# Altium schematic sheet Shift register.SchDoc
size 297 x 209 mm
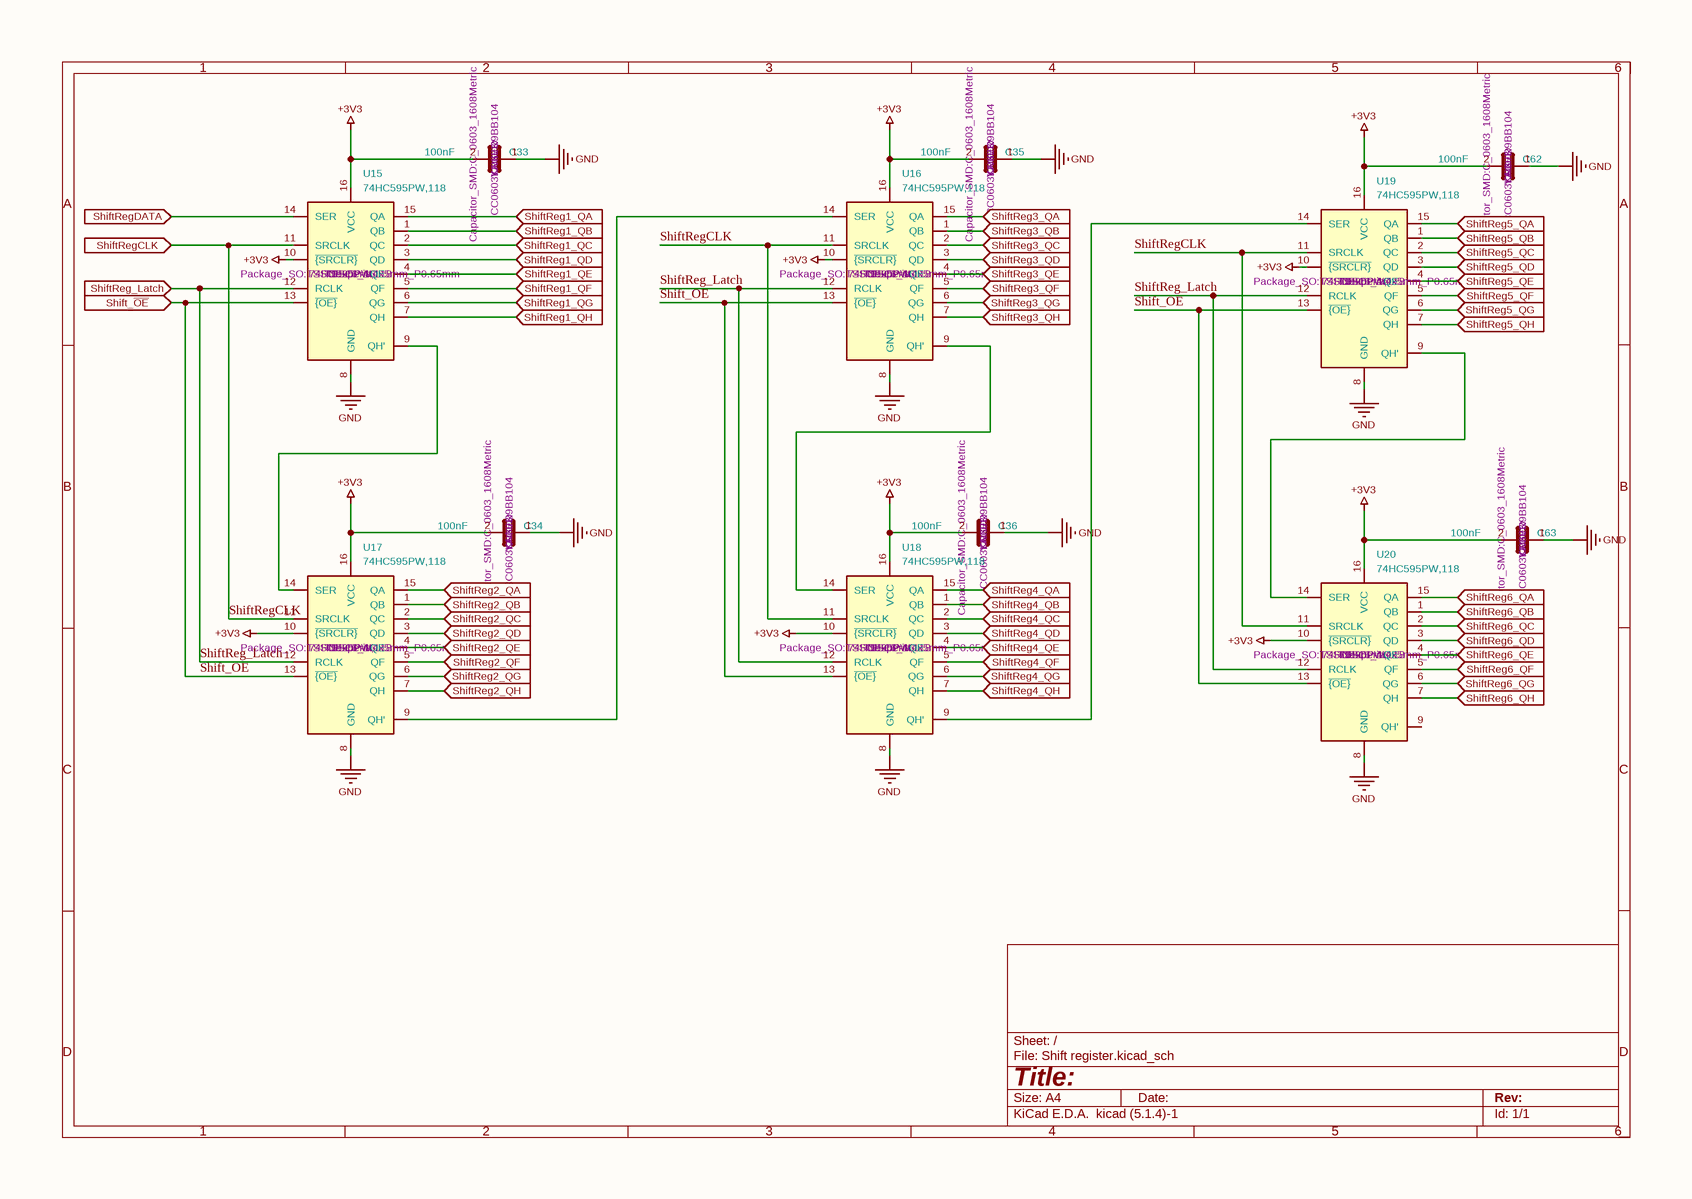
[diagram p0: Shift register.SchDoc]

## Parts
C33  Manufacturer Part Number: CC0603KRX7R9BB104  Manufacturer: YAGEO  Package: C0603  Footprint: Capacitor_SMD:C_0603_1608Metric  [C_0603_1608Metric]  (hidden comment: 100nF)
C34  Manufacturer Part Number: CC0603KRX7R9BB104  Manufacturer: YAGEO  Package: C0603  Footprint: Capacitor_SMD:C_0603_1608Metric  [C_0603_1608Metric]  (hidden comment: 100nF)
C35  Manufacturer Part Number: CC0603KRX7R9BB104  Manufacturer: YAGEO  Package: C0603  Footprint: Capacitor_SMD:C_0603_1608Metric  [C_0603_1608Metric]  (hidden comment: 100nF)
C36  Manufacturer Part Number: CC0603KRX7R9BB104  Manufacturer: YAGEO  Package: C0603  Footprint: Capacitor_SMD:C_0603_1608Metric  [C_0603_1608Metric]  (hidden comment: 100nF)
C62  Manufacturer Part Number: CC0603KRX7R9BB104  Manufacturer: YAGEO  Package: C0603  Footprint: Capacitor_SMD:C_0603_1608Metric  [C_0603_1608Metric]  (hidden comment: 100nF)
C63  Manufacturer Part Number: CC0603KRX7R9BB104  Manufacturer: YAGEO  Package: C0603  Footprint: Capacitor_SMD:C_0603_1608Metric  [C_0603_1608Metric]  (hidden comment: 100nF)
U15  Manufacturer: Nexperia  Package: TSSOP-16  Footprint: Package_SO:TSSOP-16_4.4x5mm_P0.65mm  [TSSOP-16_4.4x5mm_P0.65mm]  (hidden comment: 74HC595PW,118)
U16  Manufacturer: Nexperia  Package: TSSOP-16  Footprint: Package_SO:TSSOP-16_4.4x5mm_P0.65mm  [TSSOP-16_4.4x5mm_P0.65mm]  (hidden comment: 74HC595PW,118)
U17  Manufacturer: Nexperia  Package: TSSOP-16  Footprint: Package_SO:TSSOP-16_4.4x5mm_P0.65mm  [TSSOP-16_4.4x5mm_P0.65mm]  (hidden comment: 74HC595PW,118)
U18  Manufacturer: Nexperia  Package: TSSOP-16  Footprint: Package_SO:TSSOP-16_4.4x5mm_P0.65mm  [TSSOP-16_4.4x5mm_P0.65mm]  (hidden comment: 74HC595PW,118)
U19  Manufacturer: Nexperia  Package: TSSOP-16  Footprint: Package_SO:TSSOP-16_4.4x5mm_P0.65mm  [TSSOP-16_4.4x5mm_P0.65mm]  (hidden comment: 74HC595PW,118)
U20  Manufacturer: Nexperia  Package: TSSOP-16  Footprint: Package_SO:TSSOP-16_4.4x5mm_P0.65mm  [TSSOP-16_4.4x5mm_P0.65mm]  (hidden comment: 74HC595PW,118)

## Ports
Shift_~{OE} (in, see KNX-RELAY-24CH_V0.2[4A]), ShiftReg1_QA (in, see KNX-RELAY-24CH_V0.2[3C]), ShiftReg1_QB (in, see KNX-RELAY-24CH_V0.2[3C]), ShiftReg1_QC (in, see KNX-RELAY-24CH_V0.2[3C]), ShiftReg1_QD (in, see KNX-RELAY-24CH_V0.2[3C]), ShiftReg1_QE (in, see KNX-RELAY-24CH_V0.2[3C]), ShiftReg1_QF (in, see KNX-RELAY-24CH_V0.2[3A]), ShiftReg1_QG (in, see KNX-RELAY-24CH_V0.2[3B]), ShiftReg1_QH (in, see KNX-RELAY-24CH_V0.2[3A]), ShiftReg2_QA (in, see KNX-RELAY-24CH_V0.2[3B]), ShiftReg2_QB (in, see KNX-RELAY-24CH_V0.2[3A]), ShiftReg2_QC (in, see KNX-RELAY-24CH_V0.2[3B]), ShiftReg2_QD (in, see KNX-RELAY-24CH_V0.2[3A]), ShiftReg2_QE (in, see KNX-RELAY-24CH_V0.2[3B]), ShiftReg2_QF (in, see KNX-RELAY-24CH_V0.2[3A]), ShiftReg2_QG (in, see KNX-RELAY-24CH_V0.2[3B]), ShiftReg2_QH (in, see KNX-RELAY-24CH_V0.2[3A]), ShiftReg3_QA (in, see KNX-RELAY-24CH_V0.2[3B]), ShiftReg3_QB (in, see KNX-RELAY-24CH_V0.2[3A]), ShiftReg3_QC (in, see KNX-RELAY-24CH_V0.2[3B]), ShiftReg3_QD (in, see KNX-RELAY-24CH_V0.2[3C]), ShiftReg3_QE (in, see KNX-RELAY-24CH_V0.2[3C]), ShiftReg3_QF (in, see KNX-RELAY-24CH_V0.2[3C]), ShiftReg3_QG (in, see KNX-RELAY-24CH_V0.2[3C]), ShiftReg3_QH (in, see KNX-RELAY-24CH_V0.2[3B]), ShiftReg4_QA (in, see KNX-RELAY-24CH_V0.2[3B]), ShiftReg4_QB (in, see KNX-RELAY-24CH_V0.2[3B]), ShiftReg4_QC (in, see KNX-RELAY-24CH_V0.2[3B]), ShiftReg4_QD (in, see KNX-RELAY-24CH_V0.2[3B]), ShiftReg4_QE (in, see KNX-RELAY-24CH_V0.2[3C]), ShiftReg4_QF (in, see KNX-RELAY-24CH_V0.2[3C]), ShiftReg4_QG (in, see KNX-RELAY-24CH_V0.2[3C]), ShiftReg4_QH (in, see KNX-RELAY-24CH_V0.2[3C]), ShiftReg5_QA (in, see KNX-RELAY-24CH_V0.2[3A]), ShiftReg5_QB (in, see KNX-RELAY-24CH_V0.2[3B]), ShiftReg5_QC (in, see KNX-RELAY-24CH_V0.2[3A]), ShiftReg5_QD (in, see KNX-RELAY-24CH_V0.2[3B]), ShiftReg5_QE (in, see KNX-RELAY-24CH_V0.2[3A]), ShiftReg5_QF (in, see KNX-RELAY-24CH_V0.2[3B]), ShiftReg5_QG (in, see KNX-RELAY-24CH_V0.2[3A]), ShiftReg5_QH (in, see KNX-RELAY-24CH_V0.2[3B]), ShiftReg6_QA (in, see KNX-RELAY-24CH_V0.2[3A]), ShiftReg6_QB (in, see KNX-RELAY-24CH_V0.2[3B]), ShiftReg6_QC (in, see KNX-RELAY-24CH_V0.2[3A]), ShiftReg6_QD (in, see KNX-RELAY-24CH_V0.2[3C]), ShiftReg6_QE (in, see KNX-RELAY-24CH_V0.2[3C]), ShiftReg6_QF (in, see KNX-RELAY-24CH_V0.2[3C]), ShiftReg6_QG (in, see KNX-RELAY-24CH_V0.2[3C]), ShiftReg6_QH (in, see KNX-RELAY-24CH_V0.2[3C]), ShiftReg_Latch (in, see KNX-RELAY-24CH_V0.2[4A]), ShiftRegCLK (in, see KNX-RELAY-24CH_V0.2[4A]), ShiftRegDATA (in, see KNX-RELAY-24CH_V0.2[4A])

## Nets
+3V3: C33.2 C34.2 C35.2 C36.2 C62.2 C63.2 U15.10(~{{SRCLR}}) U15.16(VCC) U16.10(~{{SRCLR}}) U16.16(VCC) U17.10(~{{SRCLR}}) U17.16(VCC) U18.10(~{{SRCLR}}) U18.16(VCC) U19.10(~{{SRCLR}}) U19.16(VCC) U20.10(~{{SRCLR}}) U20.16(VCC)
GND: C33.1 C34.1 C35.1 C36.1 C62.1 C63.1 U15.8(GND) U16.8(GND) U17.8(GND) U18.8(GND) U19.8(GND) U20.8(GND)
Shift_~{OE}: U15.13(~{{OE}}) U16.13(~{{OE}}) U17.13(~{{OE}}) U18.13(~{{OE}}) U19.13(~{{OE}}) U20.13(~{{OE}}) ; port Shift_~{OE}
ShiftReg1_QA: U15.15(QA) ; port ShiftReg1_QA
ShiftReg1_QB: U15.1(QB) ; port ShiftReg1_QB
ShiftReg1_QC: U15.2(QC) ; port ShiftReg1_QC
ShiftReg1_QD: U15.3(QD) ; port ShiftReg1_QD
ShiftReg1_QE: U15.4(QE) ; port ShiftReg1_QE
ShiftReg1_QF: U15.5(QF) ; port ShiftReg1_QF
ShiftReg1_QG: U15.6(QG) ; port ShiftReg1_QG
ShiftReg1_QH: U15.7(QH) ; port ShiftReg1_QH
ShiftReg2_QA: U17.15(QA) ; port ShiftReg2_QA
ShiftReg2_QB: U17.1(QB) ; port ShiftReg2_QB
ShiftReg2_QC: U17.2(QC) ; port ShiftReg2_QC
ShiftReg2_QD: U17.3(QD) ; port ShiftReg2_QD
ShiftReg2_QE: U17.4(QE) ; port ShiftReg2_QE
ShiftReg2_QF: U17.5(QF) ; port ShiftReg2_QF
ShiftReg2_QG: U17.6(QG) ; port ShiftReg2_QG
ShiftReg2_QH: U17.7(QH) ; port ShiftReg2_QH
ShiftReg3_QA: U16.15(QA) ; port ShiftReg3_QA
ShiftReg3_QB: U16.1(QB) ; port ShiftReg3_QB
ShiftReg3_QC: U16.2(QC) ; port ShiftReg3_QC
ShiftReg3_QD: U16.3(QD) ; port ShiftReg3_QD
ShiftReg3_QE: U16.4(QE) ; port ShiftReg3_QE
ShiftReg3_QF: U16.5(QF) ; port ShiftReg3_QF
ShiftReg3_QG: U16.6(QG) ; port ShiftReg3_QG
ShiftReg3_QH: U16.7(QH) ; port ShiftReg3_QH
ShiftReg4_QA: U18.15(QA) ; port ShiftReg4_QA
ShiftReg4_QB: U18.1(QB) ; port ShiftReg4_QB
ShiftReg4_QC: U18.2(QC) ; port ShiftReg4_QC
ShiftReg4_QD: U18.3(QD) ; port ShiftReg4_QD
ShiftReg4_QE: U18.4(QE) ; port ShiftReg4_QE
ShiftReg4_QF: U18.5(QF) ; port ShiftReg4_QF
ShiftReg4_QG: U18.6(QG) ; port ShiftReg4_QG
ShiftReg4_QH: U18.7(QH) ; port ShiftReg4_QH
ShiftReg5_QA: U19.15(QA) ; port ShiftReg5_QA
ShiftReg5_QB: U19.1(QB) ; port ShiftReg5_QB
ShiftReg5_QC: U19.2(QC) ; port ShiftReg5_QC
ShiftReg5_QD: U19.3(QD) ; port ShiftReg5_QD
ShiftReg5_QE: U19.4(QE) ; port ShiftReg5_QE
ShiftReg5_QF: U19.5(QF) ; port ShiftReg5_QF
ShiftReg5_QG: U19.6(QG) ; port ShiftReg5_QG
ShiftReg5_QH: U19.7(QH) ; port ShiftReg5_QH
ShiftReg6_QA: U20.15(QA) ; port ShiftReg6_QA
ShiftReg6_QB: U20.1(QB) ; port ShiftReg6_QB
ShiftReg6_QC: U20.2(QC) ; port ShiftReg6_QC
ShiftReg6_QD: U20.3(QD) ; port ShiftReg6_QD
ShiftReg6_QE: U20.4(QE) ; port ShiftReg6_QE
ShiftReg6_QF: U20.5(QF) ; port ShiftReg6_QF
ShiftReg6_QG: U20.6(QG) ; port ShiftReg6_QG
ShiftReg6_QH: U20.7(QH) ; port ShiftReg6_QH
ShiftReg_Latch: U15.12(RCLK) U16.12(RCLK) U17.12(RCLK) U18.12(RCLK) U19.12(RCLK) U20.12(RCLK) ; port ShiftReg_Latch
ShiftRegCLK: U15.11(SRCLK) U16.11(SRCLK) U17.11(SRCLK) U18.11(SRCLK) U19.11(SRCLK) U20.11(SRCLK) ; port ShiftRegCLK
ShiftRegDATA: U15.14(SER) ; port ShiftRegDATA
NetU15_9: U15.9(QH') U17.14(SER)
NetU16_9: U16.9(QH') U18.14(SER)
NetU16_14: U16.14(SER) U17.9(QH')
NetU18_9: U18.9(QH') U19.14(SER)
NetU19_9: U19.9(QH') U20.14(SER)

Not connected (* = marked no-connect by the designer): U20 9(QH')

## Notes on the sheet
- 1
- 2
- 3
- 4
- 5
- 6
- A
- B
- C
- D
- Title:
- File: Shift register.kicad_sch
- Sheet: /
- KiCad E.D.A.  kicad (5.1.4)-1
- Size: A4
- Date:
- Rev:
- Id: 1/1

## Library data of the parts
C33-C36 C62 C63 = C: Value: 100nF
U15-U20 = 74HC595: Manufacturer Part Number: 74HC595PW,118; Value: 74HC595PW,118